# Altium schematic sheet LCD.SchDoc
size A4
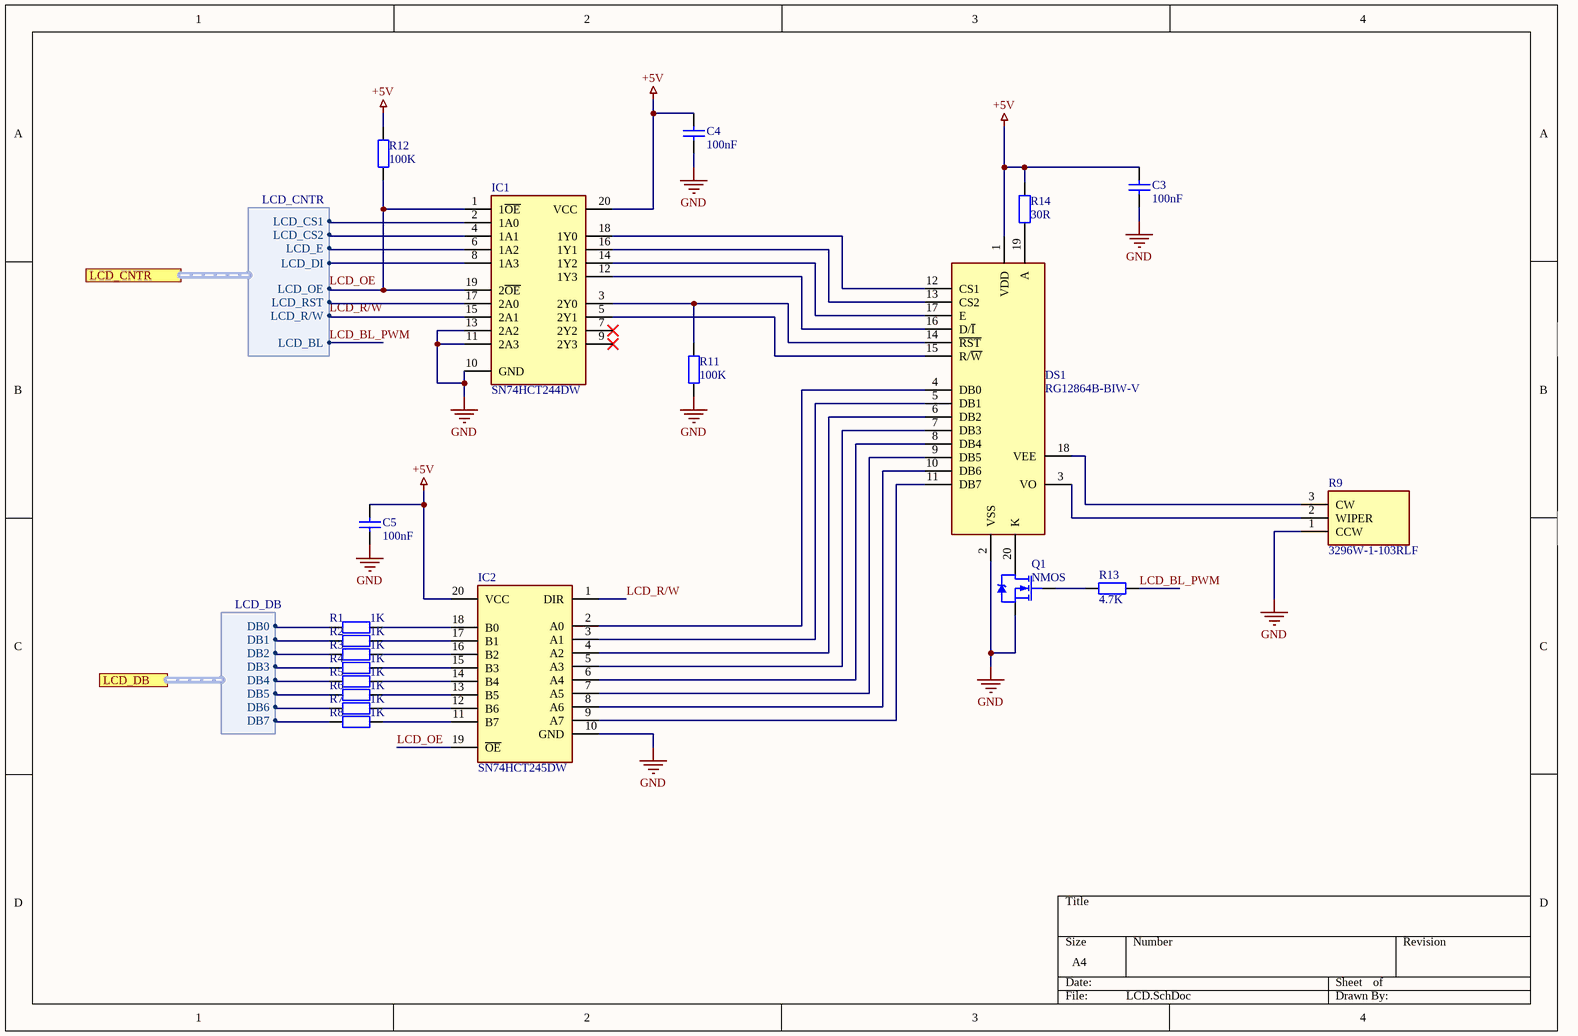
[diagram p0: LCD.SchDoc]

## Parts
C3  100nF  [FP_0805_CAP_085]
C4  100nF  [FP_0805_CAP_085]
C5  100nF  [FP_0805_CAP_085]
DS1  RG12864B-BIW-V  [RG12864B-BIW-V_AUT]
IC1  SN74HCT244DW  [SN74HCT244DW]
IC2  SN74HCT245DW  [SN74HCT245DW]
Q1  NMOS  [FP_SOT23-3]
R1  1K  [FP_0805_RES]
R2  1K  [FP_0805_RES]
R3  1K  [FP_0805_RES]
R4  1K  [FP_0805_RES]
R5  1K  [FP_0805_RES]
R6  1K  [FP_0805_RES]
R7  1K  [FP_0805_RES]
R8  1K  [FP_0805_RES]
R9  3296W-1-103RLF  [3296W-1-103R]
R11  100K  [FP_0805_RES]
R12  100K  [FP_0805_RES]
R13  4.7K  [FP_0805_RES]
R14  30R  [FP_0805_RES]

## Ports
LCD_CNTR (harness LCD_CNTR), LCD_DB (harness LCD_DB)

## Harnesses
LCD_DB: DB0, DB1, DB2, DB3, DB4, DB5, DB6, DB7
LCD_CNTR: LCD_CS1, LCD_CS2, LCD_E, LCD_DI, LCD_RST, LCD_R/W, LCD_OE, LCD_BL

## Nets
+5V: C3.2 C4.2 C5.2 DS1.1(VDD) IC1.20(VCC) IC2.20(VCC) R12.1 R14.2
GND: C3.1 C4.1 C5.1 DS1.2(VSS) IC1.10(GND) IC1.11(2A3) IC1.13(2A2) IC2.10(GND) Q1.3(S) R9.1(CCW) R11.1
LCD_BL_PWM: R13.2 ; port LCD_CNTR.LCD_BL
LCD_OE: IC1.1(1~{OE}) IC1.19(2~{OE}) IC2.19(~{OE}) R12.2 ; port LCD_CNTR.LCD_OE
LCD_R/W: IC1.15(2A1) IC2.1(DIR) ; port LCD_CNTR.LCD_R/W
NetDS1_3: DS1.3(VO) R9.2(WIPER)
NetDS1_4: DS1.4(DB0) IC2.2(A0)
NetDS1_5: DS1.5(DB1) IC2.3(A1)
NetDS1_6: DS1.6(DB2) IC2.4(A2)
NetDS1_7: DS1.7(DB3) IC2.5(A3)
NetDS1_8: DS1.8(DB4) IC2.6(A4)
NetDS1_9: DS1.9(DB5) IC2.7(A5)
NetDS1_10: DS1.10(DB6) IC2.8(A6)
NetDS1_11: DS1.11(DB7) IC2.9(A7)
NetDS1_12: DS1.12(CS1) IC1.18(1Y0)
NetDS1_13: DS1.13(CS2) IC1.16(1Y1)
NetDS1_14: DS1.14(~{RST}) IC1.3(2Y0) R11.2
NetDS1_15: DS1.15(R/~{W}) IC1.5(2Y1)
NetDS1_16: DS1.16(D/~{I}) IC1.12(1Y3)
NetDS1_17: DS1.17(E) IC1.14(1Y2)
NetDS1_18: DS1.18(VEE) R9.3(CW)
NetDS1_19: DS1.19(A) R14.1
NetDS1_20: DS1.20(K) Q1.2(D)
NetIC1_2: IC1.2(1A0) ; port LCD_CNTR.LCD_CS1
NetIC1_4: IC1.4(1A1) ; port LCD_CNTR.LCD_CS2
NetIC1_6: IC1.6(1A2) ; port LCD_CNTR.LCD_E
NetIC1_8: IC1.8(1A3) ; port LCD_CNTR.LCD_DI
NetIC1_17: IC1.17(2A0) ; port LCD_CNTR.LCD_RST
NetIC2_11: IC2.11(B7) R8.2
NetIC2_12: IC2.12(B6) R7.2
NetIC2_13: IC2.13(B5) R6.2
NetIC2_14: IC2.14(B4) R5.2
NetIC2_15: IC2.15(B3) R4.2
NetIC2_16: IC2.16(B2) R3.2
NetIC2_17: IC2.17(B1) R2.2
NetIC2_18: IC2.18(B0) R1.2
NetQ1_1: Q1.1(G) R13.1
NetR1_1: R1.1 ; port LCD_DB.DB0
NetR2_1: R2.1 ; port LCD_DB.DB1
NetR3_1: R3.1 ; port LCD_DB.DB2
NetR4_1: R4.1 ; port LCD_DB.DB3
NetR5_1: R5.1 ; port LCD_DB.DB4
NetR6_1: R6.1 ; port LCD_DB.DB5
NetR7_1: R7.1 ; port LCD_DB.DB6
NetR8_1: R8.1 ; port LCD_DB.DB7

Not connected (* = marked no-connect by the designer): DS1 MH1 MH2 MH3 MH4; IC1 7(2Y2)* 9(2Y3)*

## Library data of the parts
C3-C5 = 100nF_0805_CAP: Capacitor; Value: 100nF
DS1 = RG12864B-BIW-V: Display; Manufacturer_Name: RAYSTAR; Manufacturer_Part_Number: RG12864B-GHW-V; Datasheet Link: https://www.tme.eu/Document/ad0edd8197c217e1346010bf2253878c/RG12864B-GHW-V.pdf; Height: 5.9mm; Supplier: Lomex; Reference: 37-00-81
IC1 = SN74HCT244DW: Integrated Circuit; Manufacturer_Name: Texas Instruments; Datasheet Link: http://www.ti.com/lit/ds/symlink/sn74hct244.pdf; Height: 2.65mm; Manufacturer_Part_Number: SN74HCT244DW; Mouser Part Number: 595-SN74HCT244DW; Mouser Price/Stock: https://www.mouser.co.uk/ProductDetail/Texas-Instruments/SN74HCT244DW?qs=8yeEWhuAOtPaf02S2l6zdA%3D%3D; Arrow Part Number: SN74HCT244DW; Arrow Price/Stock: https://www.arrow.com/en/products/sn74hct244dw/texas-instruments
IC2 = SN74HCT245DW: Integrated Circuit; Manufacturer_Name: Texas Instruments; Datasheet Link: http://www.ti.com/lit/ds/symlink/sn74hct245.pdf; Height: 2.65mm; Manufacturer_Part_Number: SN74HCT245DW; Mouser Part Number: 595-SN74HCT245DW; Mouser Price/Stock: https://www.mouser.co.uk/ProductDetail/Texas-Instruments/SN74HCT245DW?qs=5h8QSfodyRguwsnqzMvAgw%3D%3D; Arrow Part Number: SN74HCT245DW; Arrow Price/Stock: https://www.arrow.com/en/products/sn74hct245dw/texas-instruments?region=nac
Q1 = Si2308BDS: pin to pad: 2>3 3>2; Name: N-FET; Supplier: Lomex; Reference: 86-02-05
R1-R8 = 1K_0805_RES: Resistor; Value: 1K
R9 = 3296W-1-103RLF: Resistor; Manufacturer_Name: Bourns; Datasheet Link: https://www.bourns.com/pdfs/3296.pdf; Manufacturer_Part_Number: 3296W-1-103RLF; Mouser Part Number: 652-3296W-1-103RLF; Mouser Price/Stock: https://www.mouser.co.uk/ProductDetail/Bourns/3296W-1-103RLF?qs=2bTIwLLrckTSiNyA4dRdUg%3D%3D; Arrow Part Number: 3296W-1-103RLF; Arrow Price/Stock: https://www.arrow.com/en/products/3296w-1-103rlf/bourns?region=nac; Supplier: Lomex; Reference: 05-05-89
R11 = 10K_0805_RES: Resistor; Value: 100K
R12 = 100K_0805_RES: Resistor; Value: 100K
R13 = 4_7K_0805_RES: Resistor; Value: 4.7K
R14 = 30R_0805_RES: Resistor; Value: 30R